# EAGLE schematic Edge-Lit Clock v3.1 (EAGLE 7.6.0)
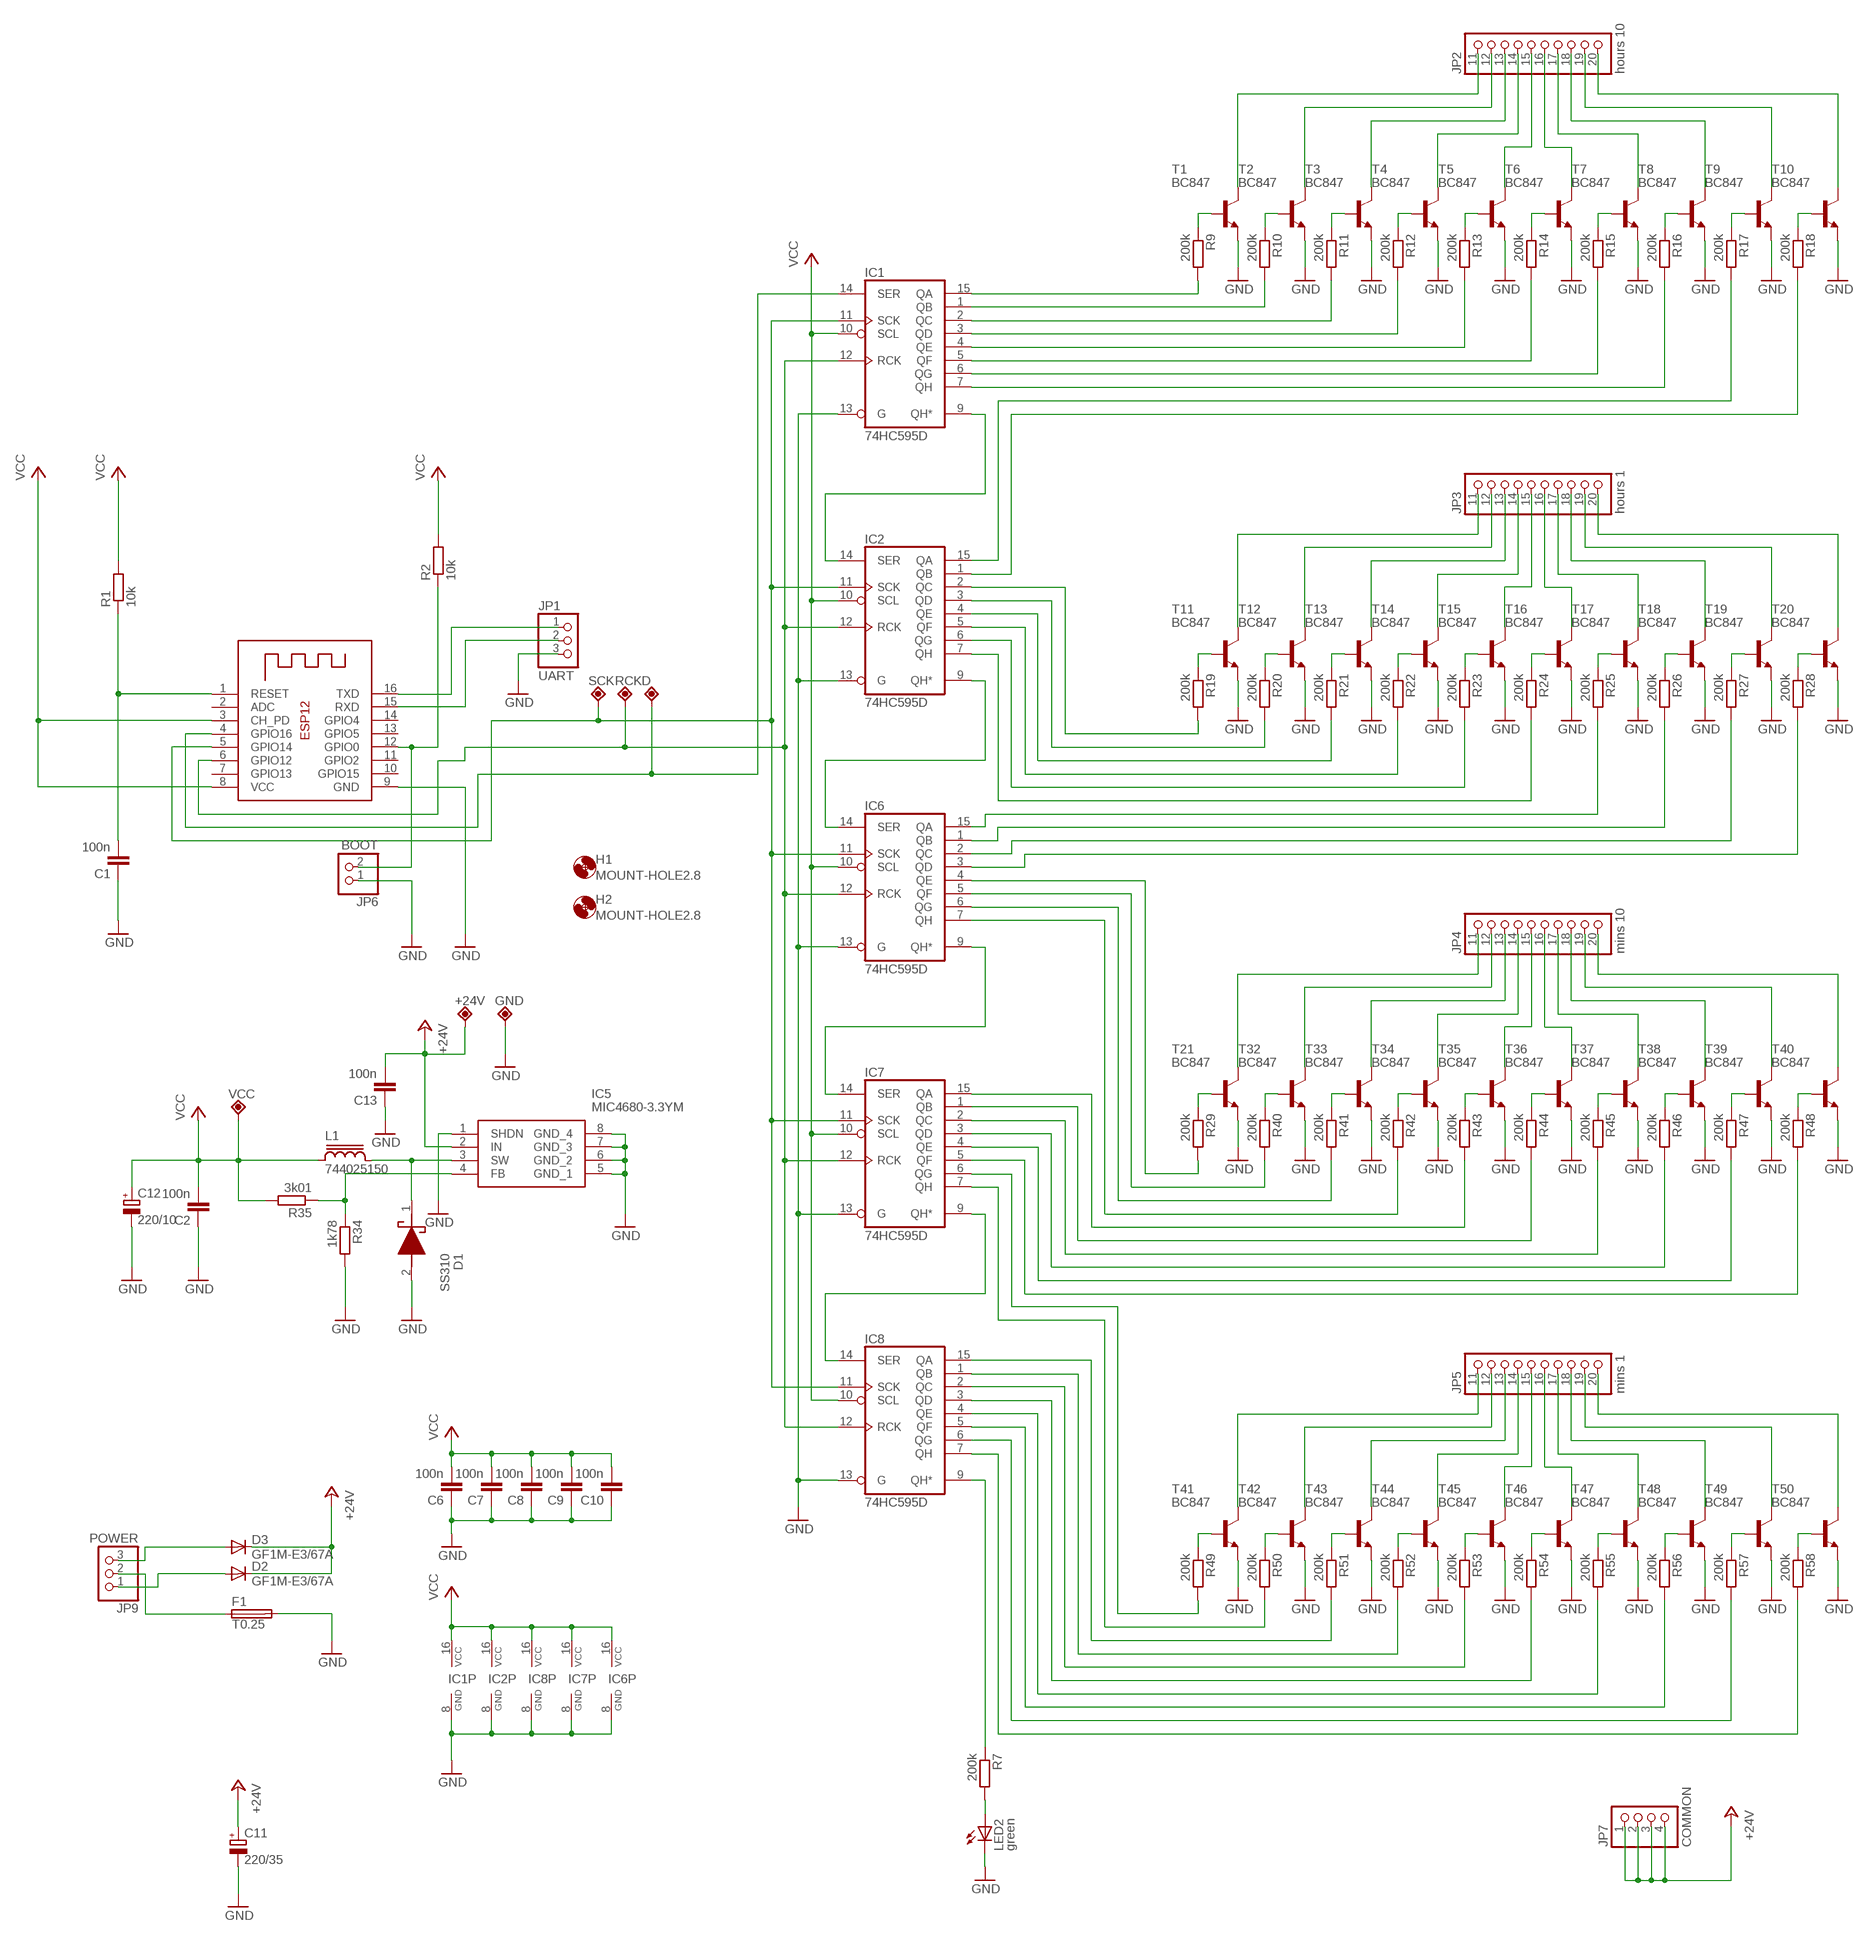
[diagram p0: schematic, sheet 1]

## Parts
+24V  TPP-PAD-024  [PAD-024]
C1  100n  C-EUC0805  [C0805]
C2  100n  C-EUC0805  [C0805]
C6  100n  C-EUC0805  [C0805]
C7  100n  C-EUC0805  [C0805]
C8  100n  C-EUC0805  [C0805]
C9  100n  C-EUC0805  [C0805]
C10  100n  C-EUC0805  [C0805]
C11  220/35  CPOL-EUSANYO_SMD_E7  [SANYO-OSCON_SMD_E7]
C12  220/10  CPOL-EUSANYO_SMD_E7  [SANYO-OSCON_SMD_E7]
C13  100n  C-EUC0805  [C0805]
D  TPP-PAD-024  [PAD-024]
D1  SS310  [DIOM7959X262N]
D2  GF1M-E3/67A  DIODE-DO214BA  [DO214BA]
D3  GF1M-E3/67A  DIODE-DO214BA  [DO214BA]
F1  T0.25  TE5  [TE5]
GND  TPP-PAD-024  [PAD-024]
H1  MOUNT-HOLE2.8  [2,8]
H2  MOUNT-HOLE2.8  [2,8]
IC1  74HC595D  [SO16]
IC2  74HC595D  [SO16]
IC5  MIC4680-3.3YM  [SOIC127P599X173-8N]
IC6  74HC595D  [SO16]
IC7  74HC595D  [SO16]
IC8  74HC595D  [SO16]
JP1  UART  PINHD-1X3  [1X03]
JP2  hours 10  PINHD-1X10  [1X10]
JP3  hours 1  PINHD-1X10  [1X10]
JP4  mins 10  PINHD-1X10  [1X10]
JP5  mins 1  PINHD-1X10  [1X10]
JP6  BOOT  PINHD-1X2  [1X02]
JP7  COMMON  PINHD-1X4  [1X04]
JP9  POWER  PINHD-1X3  [1X03]
L1  744025150  [744025150]
LED2  green  LEDSML0805  [SML0805]
R1  10k  R-EU_M0805  [M0805]
R2  10k  R-EU_M0805  [M0805]
R7  200k  R-EU_M0805  [M0805]
R9  200k  R-EU_M0805  [M0805]
R10  200k  R-EU_M0805  [M0805]
R11  200k  R-EU_M0805  [M0805]
R12  200k  R-EU_M0805  [M0805]
R13  200k  R-EU_M0805  [M0805]
R14  200k  R-EU_M0805  [M0805]
R15  200k  R-EU_M0805  [M0805]
R16  200k  R-EU_M0805  [M0805]
R17  200k  R-EU_M0805  [M0805]
R18  200k  R-EU_M0805  [M0805]
R19  200k  R-EU_M0805  [M0805]
R20  200k  R-EU_M0805  [M0805]
R21  200k  R-EU_M0805  [M0805]
R22  200k  R-EU_M0805  [M0805]
R23  200k  R-EU_M0805  [M0805]
R24  200k  R-EU_M0805  [M0805]
R25  200k  R-EU_M0805  [M0805]
R26  200k  R-EU_M0805  [M0805]
R27  200k  R-EU_M0805  [M0805]
R28  200k  R-EU_M0805  [M0805]
R29  200k  R-EU_M0805  [M0805]
R34  1k78  R-EU_M0805  [M0805]
R35  3k01  R-EU_M0805  [M0805]
R40  200k  R-EU_M0805  [M0805]
R41  200k  R-EU_M0805  [M0805]
R42  200k  R-EU_M0805  [M0805]
R43  200k  R-EU_M0805  [M0805]
R44  200k  R-EU_M0805  [M0805]
R45  200k  R-EU_M0805  [M0805]
R46  200k  R-EU_M0805  [M0805]
R47  200k  R-EU_M0805  [M0805]
R48  200k  R-EU_M0805  [M0805]
R49  200k  R-EU_M0805  [M0805]
R50  200k  R-EU_M0805  [M0805]
R51  200k  R-EU_M0805  [M0805]
R52  200k  R-EU_M0805  [M0805]
R53  200k  R-EU_M0805  [M0805]
R54  200k  R-EU_M0805  [M0805]
R55  200k  R-EU_M0805  [M0805]
R56  200k  R-EU_M0805  [M0805]
R57  200k  R-EU_M0805  [M0805]
R58  200k  R-EU_M0805  [M0805]
RCK  TPP-PAD-024  [PAD-024]
SCK  TPP-PAD-024  [PAD-024]
T1  BC847  [SOT23]
T2  BC847  [SOT23]
T3  BC847  [SOT23]
T4  BC847  [SOT23]
T5  BC847  [SOT23]
T6  BC847  [SOT23]
T7  BC847  [SOT23]
T8  BC847  [SOT23]
T9  BC847  [SOT23]
T10  BC847  [SOT23]
T11  BC847  [SOT23]
T12  BC847  [SOT23]
T13  BC847  [SOT23]
T14  BC847  [SOT23]
T15  BC847  [SOT23]
T16  BC847  [SOT23]
T17  BC847  [SOT23]
T18  BC847  [SOT23]
T19  BC847  [SOT23]
T20  BC847  [SOT23]
T21  BC847  [SOT23]
T32  BC847  [SOT23]
T33  BC847  [SOT23]
T34  BC847  [SOT23]
T35  BC847  [SOT23]
T36  BC847  [SOT23]
T37  BC847  [SOT23]
T38  BC847  [SOT23]
T39  BC847  [SOT23]
T40  BC847  [SOT23]
T41  BC847  [SOT23]
T42  BC847  [SOT23]
T43  BC847  [SOT23]
T44  BC847  [SOT23]
T45  BC847  [SOT23]
T46  BC847  [SOT23]
T47  BC847  [SOT23]
T48  BC847  [SOT23]
T49  BC847  [SOT23]
T50  BC847  [SOT23]
VCC  TPP-PAD-024  [PAD-024]
X1  ESP12  ESP-12  [ESP-12]

## Nets
+24V: +24V.1(P) C11.+ C13.2 D2.C D3.C IC5.2(IN) JP7.1 JP7.2 JP7.3 JP7.4
CLOCK: IC1.11(SCK) IC2.11(SCK) IC6.11(SCK) IC7.11(SCK) IC8.11(SCK) SCK.1(P) X1.5(GPIO14)
DATA: D.1(P) IC1.14(SER) X1.4(GPIO16)
GND: C1.1 C2.1 C6.1 C7.1 C8.1 C9.1 C10.1 C11.- C12.- C13.1 D1.2(A) F1.2 GND.1(P) IC1.8(GND) IC1.13(G) IC2.8(GND) IC2.13(G) IC5.1(SHDN) IC5.5(GND_1) IC5.6(GND_2) IC5.7(GND_3) IC5.8(GND_4) IC6.8(GND) IC6.13(G) IC7.8(GND) IC7.13(G) IC8.8(GND) IC8.13(G) JP1.3 JP6.1 LED2.C R34.2 T1.2(E) T2.2(E) T3.2(E) T4.2(E) T5.2(E) T6.2(E) T7.2(E) T8.2(E) T9.2(E) T10.2(E) T11.2(E) T12.2(E) T13.2(E) T14.2(E) T15.2(E) T16.2(E) T17.2(E) T18.2(E) T19.2(E) T20.2(E) T21.2(E) T32.2(E) T33.2(E) T34.2(E) T35.2(E) T36.2(E) T37.2(E) T38.2(E) T39.2(E) T40.2(E) T41.2(E) T42.2(E) T43.2(E) T44.2(E) T45.2(E) T46.2(E) T47.2(E) T48.2(E) T49.2(E) T50.2(E) X1.9(GND)
N$1: R9.1 T1.1(B)
N$2: R10.1 T2.1(B)
N$3: R11.1 T3.1(B)
N$4: R12.1 T4.1(B)
N$5: R13.1 T5.1(B)
N$6: R14.1 T6.1(B)
N$7: R15.1 T7.1(B)
N$8: R16.1 T8.1(B)
N$9: R17.1 T9.1(B)
N$10: IC6.9(QH*) IC7.14(SER)
N$11: IC1.15(QA) R9.2
N$12: IC1.1(QB) R10.2
N$13: IC1.2(QC) R11.2
N$14: C1.2 R1.1 X1.1(RESET)
N$15: IC1.3(QD) R12.2
N$16: JP6.2 R2.1 X1.12(GPIO0)
N$17: IC1.4(QE) R13.2
N$18: JP1.1 X1.16(TXD)
N$19: IC1.5(QF) R14.2
N$20: IC1.6(QG) R15.2
N$21: IC1.7(QH) R16.2
N$22: IC2.15(QA) R17.2
N$23: JP2.14 T4.3(C)
N$24: JP1.2 X1.15(RXD)
N$25: IC2.9(QH*) IC6.14(SER)
N$26: JP2.15 T5.3(C)
N$27: JP2.13 T3.3(C)
N$28: JP2.12 T2.3(C)
N$29: JP2.11 T1.3(C)
N$30: JP2.16 T6.3(C)
N$31: JP2.17 T7.3(C)
N$32: JP2.18 T8.3(C)
N$33: JP2.19 T9.3(C)
N$34: R18.1 T10.1(B)
N$35: IC2.1(QB) R18.2
N$36: JP2.20 T10.3(C)
N$37: IC1.12(RCK) IC2.12(RCK) IC6.12(RCK) IC7.12(RCK) IC8.12(RCK) RCK.1(P) X1.6(GPIO12)
N$38: D3.A JP9.3
N$39: R19.1 T11.1(B)
N$40: R20.1 T12.1(B)
N$41: R21.1 T13.1(B)
N$42: R22.1 T14.1(B)
N$43: R23.1 T15.1(B)
N$44: R24.1 T16.1(B)
N$45: R25.1 T17.1(B)
N$46: IC7.9(QH*) IC8.14(SER)
N$47: R26.1 T18.1(B)
N$48: R27.1 T19.1(B)
N$49: IC2.2(QC) R19.2
N$50: IC2.3(QD) R20.2
N$51: IC2.4(QE) R21.2
N$52: IC2.5(QF) R22.2
N$53: IC2.6(QG) R23.2
N$54: IC2.7(QH) R24.2
N$56: IC6.15(QA) R25.2
N$57: IC6.1(QB) R26.2
N$58: IC6.2(QC) R27.2
N$59: JP3.14 T14.3(C)
N$60: JP3.15 T15.3(C)
N$61: JP3.13 T13.3(C)
N$62: JP3.12 T12.3(C)
N$63: JP3.11 T11.3(C)
N$64: IC1.9(QH*) IC2.14(SER)
N$65: JP3.16 T16.3(C)
N$66: JP3.17 T17.3(C)
N$67: JP3.18 T18.3(C)
N$68: JP3.19 T19.3(C)
N$69: R28.1 T20.1(B)
N$70: IC6.3(QD) R28.2
N$71: JP3.20 T20.3(C)
N$72: D2.A JP9.1
N$73: F1.1 JP9.2
N$74: JP4.14 T34.3(C)
N$75: JP4.15 T35.3(C)
N$76: JP4.13 T33.3(C)
N$77: R29.1 T21.1(B)
N$78: R40.1 T32.1(B)
N$79: R41.1 T33.1(B)
N$80: R42.1 T34.1(B)
N$81: R43.1 T35.1(B)
N$82: R44.1 T36.1(B)
N$83: R45.1 T37.1(B)
N$85: R46.1 T38.1(B)
N$87: R47.1 T39.1(B)
N$88: IC6.4(QE) R29.2
N$89: IC6.5(QF) R40.2
N$90: IC6.6(QG) R41.2
N$91: IC6.7(QH) R42.2
N$92: IC7.15(QA) R43.2
N$93: IC7.1(QB) R44.2
N$94: IC7.2(QC) R45.2
N$95: IC7.3(QD) R46.2
N$96: LED2.A R7.2
N$102: IC7.4(QE) R47.2
N$103: JP4.12 T32.3(C)
N$104: JP4.11 T21.3(C)
N$105: JP4.16 T36.3(C)
N$106: JP4.17 T37.3(C)
N$107: JP4.18 T38.3(C)
N$108: JP4.19 T39.3(C)
N$109: JP4.20 T40.3(C)
N$110: JP5.14 T44.3(C)
N$111: JP5.15 T45.3(C)
N$112: R48.1 T40.1(B)
N$113: IC7.5(QF) R48.2
N$114: JP5.13 T43.3(C)
N$115: JP5.12 T42.3(C)
N$116: JP5.11 T41.3(C)
N$117: JP5.16 T46.3(C)
N$118: JP5.17 T47.3(C)
N$119: JP5.18 T48.3(C)
N$120: JP5.19 T49.3(C)
N$121: R49.1 T41.1(B)
N$122: R50.1 T42.1(B)
N$123: R51.1 T43.1(B)
N$124: R52.1 T44.1(B)
N$125: R53.1 T45.1(B)
N$126: R54.1 T46.1(B)
N$127: R55.1 T47.1(B)
N$128: R56.1 T48.1(B)
N$129: R57.1 T49.1(B)
N$130: IC7.6(QG) R49.2
N$131: IC7.7(QH) R50.2
N$132: IC8.15(QA) R51.2
N$133: IC8.1(QB) R52.2
N$134: IC8.2(QC) R53.2
N$135: IC8.3(QD) R54.2
N$136: IC8.4(QE) R55.2
N$137: IC8.5(QF) R56.2
N$138: IC8.6(QG) R57.2
N$139: JP5.20 T50.3(C)
N$140: D1.1(K) IC5.3(SW) L1.2
N$141: IC5.4(FB) R34.1 R35.1
N$142: IC8.9(QH*) R7.1
N$178: R58.1 T50.1(B)
N$179: IC8.7(QH) R58.2
VCC: C2.2 C6.2 C7.2 C8.2 C9.2 C10.2 C12.+ IC1.10(SCL) IC1.16(VCC) IC2.10(SCL) IC2.16(VCC) IC6.10(SCL) IC6.16(VCC) IC7.10(SCL) IC7.16(VCC) IC8.10(SCL) IC8.16(VCC) L1.1 R1.2 R2.2 R35.2 VCC.1(P) X1.3(CH_PD) X1.8(VCC)
Unconnected: X1.2(ADC) X1.7(GPIO13) X1.10(GPIO15) X1.11(GPIO2) X1.13(GPIO5) X1.14(GPIO4)

## Library data of the parts
+24V D GND RCK SCK VCC = testpoint:TPP: TEST POINT PAD
C1 C2 C6-C10 C13 = rcl:C-EU: CAPACITOR, European symbol
C11 C12 = rcl:CPOL-EU: POLARIZED CAPACITOR, European symbol
D1 = SS310:SS310: TAIWAN SEMICONDUCTOR - SS310 - SCHOTTKY RECTIFIER, 3A, 100V, DO-214AB Source: Datasheet <https://componentsearchengine.com/Datasheets/1/SS310.pdf>; DESCRIPTION: TAIWAN SEMICONDUCTOR - SS310 - SCHOTTKY RECTIFIER, 3A, 100V, DO-214AB; HEIGHT: 2.62mm; MANUFACTURER_NAME: Taiwan Semiconductor; MANUFACTURER_PART_NUMBER: SS310; MOUSER_PART_NUMBER: 821-SS310; MOUSER_PRICE-STOCK: https://www.mouser.co.uk/ProductDetail/Taiwan-Semiconductor/SS310?qs=tHU%2FlV7kTyQnmIwIRiOFBw%3D%3D
D2 D3 = diode:DIODE-: DIODE
F1 = fuse:TE5: FUSE Wickmann; OC_FARNELL: unknown; OC_NEWARK: unknown
H1 H2 = holes:MOUNT-HOLE: MOUNTING HOLE with drill center marker
IC1 IC2 IC6-IC8 = 74xx-eu:74*595: 8-bit SHIFT REGISTER, output latch
IC5 = MIC4680-3.3YM:MIC4680-3.3YM: MICREL SEMICONDUCTOR - MIC4680-3.3YM - BUCK, 4-34VIN, 1.3A, 200KHZ, 3.3V, 8SOIC Source: Datasheet <http://ww1.microchip.com/downloads/en/DeviceDoc/mic4680.pdf>; ARROW_PART_NUMBER: MIC4680-3.3YM; ARROW_PRICE-STOCK: https://www.arrow.com/en/products/mic4680-3.3ym/microchip-technology; DESCRIPTION: MICREL SEMICONDUCTOR - MIC4680-3.3YM - BUCK, 4-34VIN, 1.3A, 200KHZ, 3.3V, 8SOIC; HEIGHT: 1.73mm; MANUFACTURER_NAME: Microchip; MANUFACTURER_PART_NUMBER: MIC4680-3.3YM; MOUSER_PART_NUMBER: 998-MIC4680-3.3YM; MOUSER_PRICE-STOCK: https://www.mouser.co.uk/ProductDetail/Microchip-Technology-Micrel/MIC4680-33YM?qs=kh6iOki%2FeLEl7qvTxSy9RA%3D%3D
JP1 JP9 = pinhead:PINHD-1X3: PIN HEADER
JP2-JP5 = pinhead:PINHD-1X10: PIN HEADER
JP6 = pinhead:PINHD-1X2: PIN HEADER
JP7 = pinhead:PINHD-1X4: PIN HEADER
L1 = inductor-wurth:744025150: POWER INDUCTOR
LED2 = led:LED: LED OSRAM: - CHIPLED LG R971, LG N971, LY N971, LG Q971, LY Q971, LO R971, LY R971 LH N974, LH R974 LS Q976, LO Q976, LY Q976 LO Q996 - Hyper CHIPLED LW Q18S LB Q993, LB Q99A, LB R99A - SideLED LS A670, LO A670, LY A670, LG A670, LP A670 LB A673, LV A673, LT A673, LW A673 LH A674 LY A675 LS A676, LA A676, LO A676, LY A676, LW A676 LS A679, LY A679, LG A679 - Hyper Micro SIDELED® LS Y876, LA Y876, LO Y876, LY Y876 LT Y87S - SmartLED LW L88C, LW L88S LB L89C, LB L89S, LG L890 LS L89K, LO L89K, LY L89K LS L896, LA L896, LO L896, LY L896 - TOPLED LS T670, LO T670, LY T670, LG T670, LP T670 LSG T670, LSP T670, LSY T670, LOP T670, LYG T670 LG T671, LOG T671, LSG T671 LB T673, LV T673, LT T673, LW T673 LH T674 LS T676, LA T676, LO T676, LY T676, LB T676, LH T676, LSB T676, LW T676 LB T67C, LV T67C, LT T67C, LS T67K, LO T67K, LY T67K, LW E67C LS E67B, LA E67B, LO E67B, LY E67B, LB E67C, LV E67C, LT E67C LW T67C LS T679, LY T679, LG T679 LS T770, LO T770, LY T770, LG T770, LP T770 LB T773, LV T773, LT T773, LW T773 LH T774 LS E675, LA E675, LY E675, LS T675 LS T776, LA T776, LO T776, LY T776, LB T776 LHGB T686 LT T68C, LB T68C - Hyper Mini TOPLED® LB M676 - Mini TOPLED Santana® LG M470 LS M47K, LO M47K, LY M47K Source: http://www.osram.convergy.de LUXEON: - LUMILED® LXK2-PW12-R00, LXK2-PW12-S00, LXK2-PW14-U00, LXK2-PW14-V00 LXK2-PM12-R00, LXK2-PM12-S00, LXK2-PM14-U00 LXK2-PE12-Q00, LXK2-PE12-R00, LXK2-PE12-S00, LXK2-PE14-T00, LXK2-PE14-U00 LXK2-PB12-K00, LXK2-PB12-L00, LXK2-PB12-M00, LXK2-PB14-N00, LXK2-PB14-P00, LXK2-PB14-Q00 LXK2-PR12-L00, LXK2-PR12-M00, LXK2-PR14-Q00, LXK2-PR14-R00 LXK2-PD12-Q00, LXK2-PD12-R00, LXK2-PD12-S00 LXK2-PH12-R00, LXK2-PH12-S00 LXK2-PL12-P00, LXK2-PL12-Q00, LXK2-PL12-R00 Source: www.luxeon.com KINGBRIGHT: KA-3528ASYC Source: www.kingbright.com
R1 R2 R7 R9-R29 R34 R35 R40-R58 = rcl:R-EU_: RESISTOR, European symbol
T1-T21 T32-T50 = transistor:BC847: NPN TRANSISTOR
X1 = adafruit:ESP-12